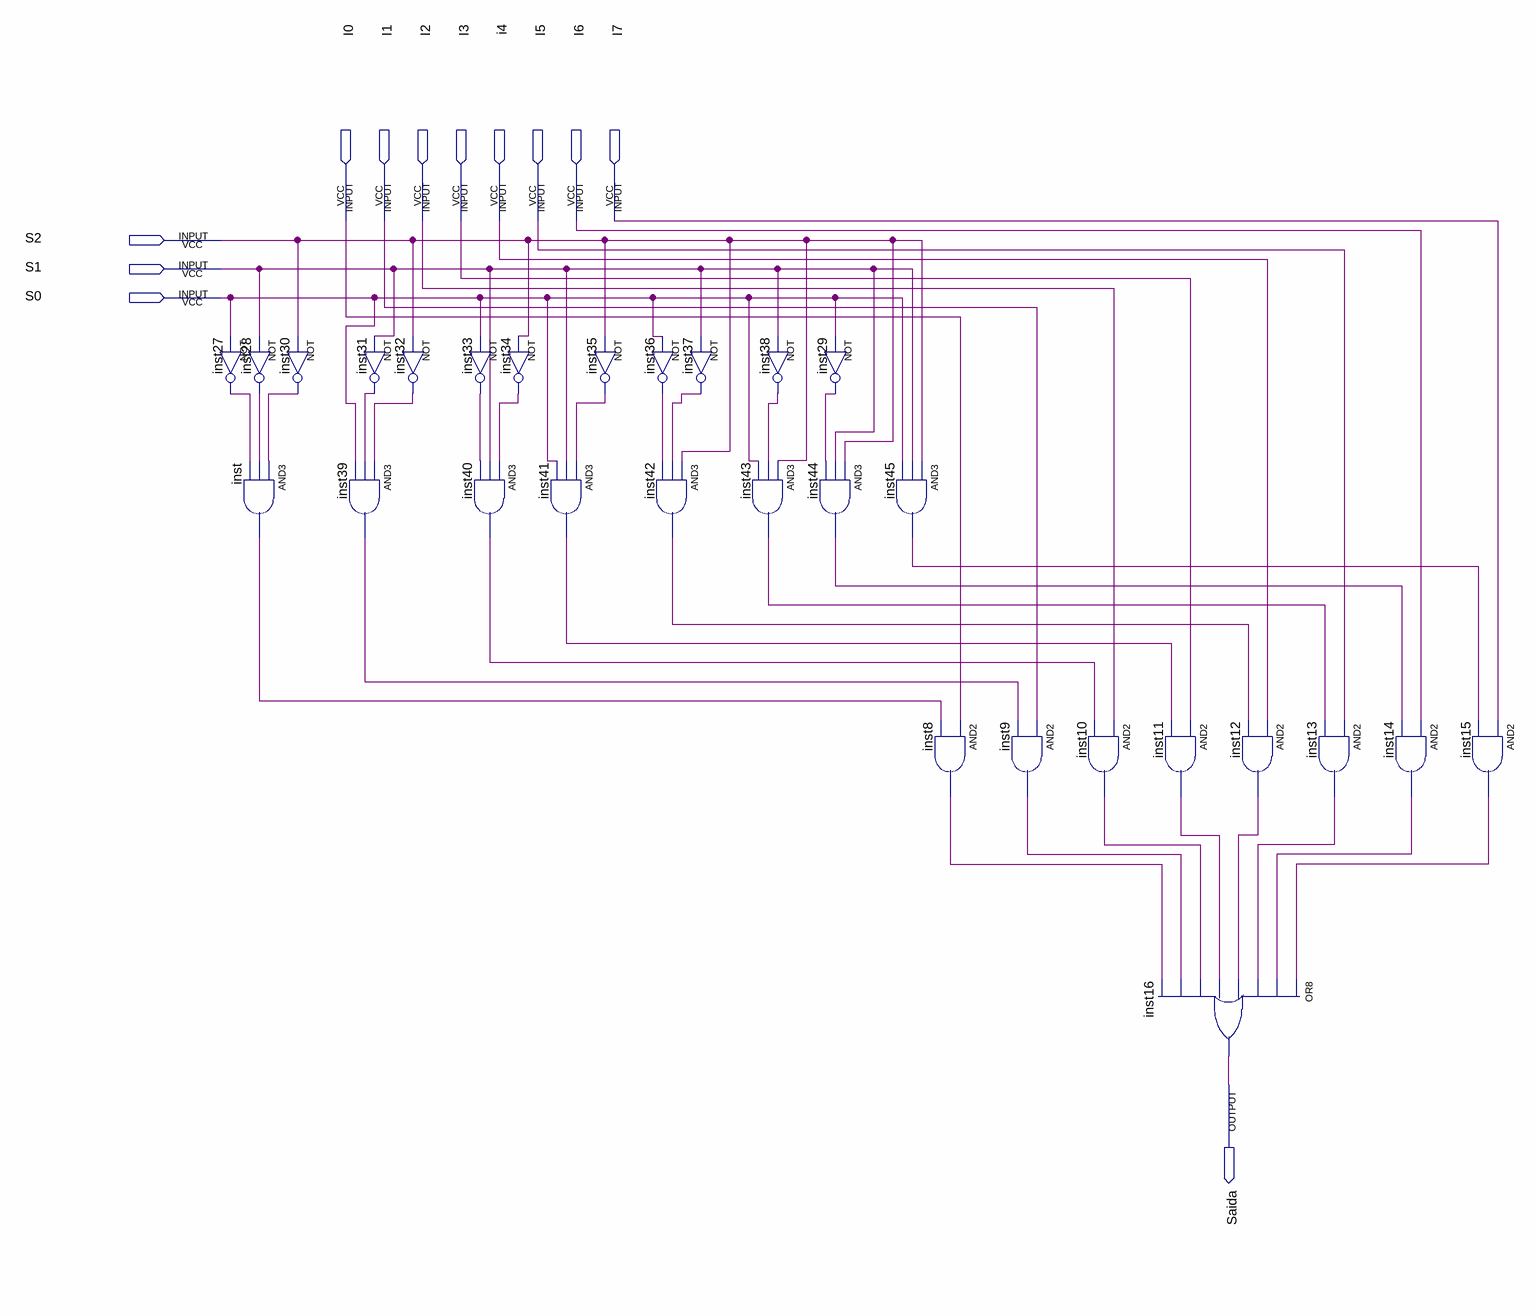
[diagram p0: schematic sheet]
// Quartus schematic Mux8x1.bdf as structural Verilog: 29 symbols, 12 pins
module Mux8x1 (
  input  I0,
  input  I1,
  input  I2,
  input  I3,
  input  i4,
  input  I5,
  input  I6,
  input  I7,
  input  S2,
  input  S1,
  input  S0,
  output Saida
);

  wire inst8_out, inst9_out, inst10_out, inst11_out, inst12_out, inst13_out, inst14_out, inst15_out,
       inst27_out, inst28_out, inst29_out, inst30_out, inst31_out, inst32_out, inst33_out, inst34_out,
       inst35_out, inst36_out, inst37_out, inst38_out, inst39_out, inst40_out, inst41_out, inst42_out,
       inst43_out, inst44_out, inst45_out, inst_out;

  not inst27 (inst27_out, S0);
  not inst28 (inst28_out, S1);
  and inst (inst_out, inst30_out, inst28_out, inst27_out);
  not inst30 (inst30_out, S2);
  not inst31 (inst31_out, S1);
  not inst32 (inst32_out, S2);
  and inst39 (inst39_out, inst32_out, inst31_out, S0);
  not inst33 (inst33_out, S0);
  and inst40 (inst40_out, inst34_out, S1, inst33_out);
  not inst34 (inst34_out, S2);
  and inst41 (inst41_out, inst35_out, S1, S0);
  not inst35 (inst35_out, S2);
  not inst36 (inst36_out, S0);
  not inst37 (inst37_out, S1);
  and inst42 (inst42_out, S2, inst37_out, inst36_out);
  not inst38 (inst38_out, S1);
  and inst43 (inst43_out, S2, inst38_out, S0);
  not inst29 (inst29_out, S0);
  and inst44 (inst44_out, S2, S1, inst29_out);
  and inst45 (inst45_out, S2, S1, S0);
  and inst8 (inst8_out, I0, inst_out);
  and inst9 (inst9_out, I1, inst39_out);
  and inst10 (inst10_out, I2, inst40_out);
  and inst11 (inst11_out, I3, inst41_out);
  or inst16 (Saida, inst15_out, inst14_out, inst13_out, inst12_out, inst11_out, inst10_out, inst9_out, inst8_out);
  and inst12 (inst12_out, i4, inst42_out);
  and inst13 (inst13_out, I5, inst43_out);
  and inst14 (inst14_out, I6, inst44_out);
  and inst15 (inst15_out, I7, inst45_out);
endmodule
